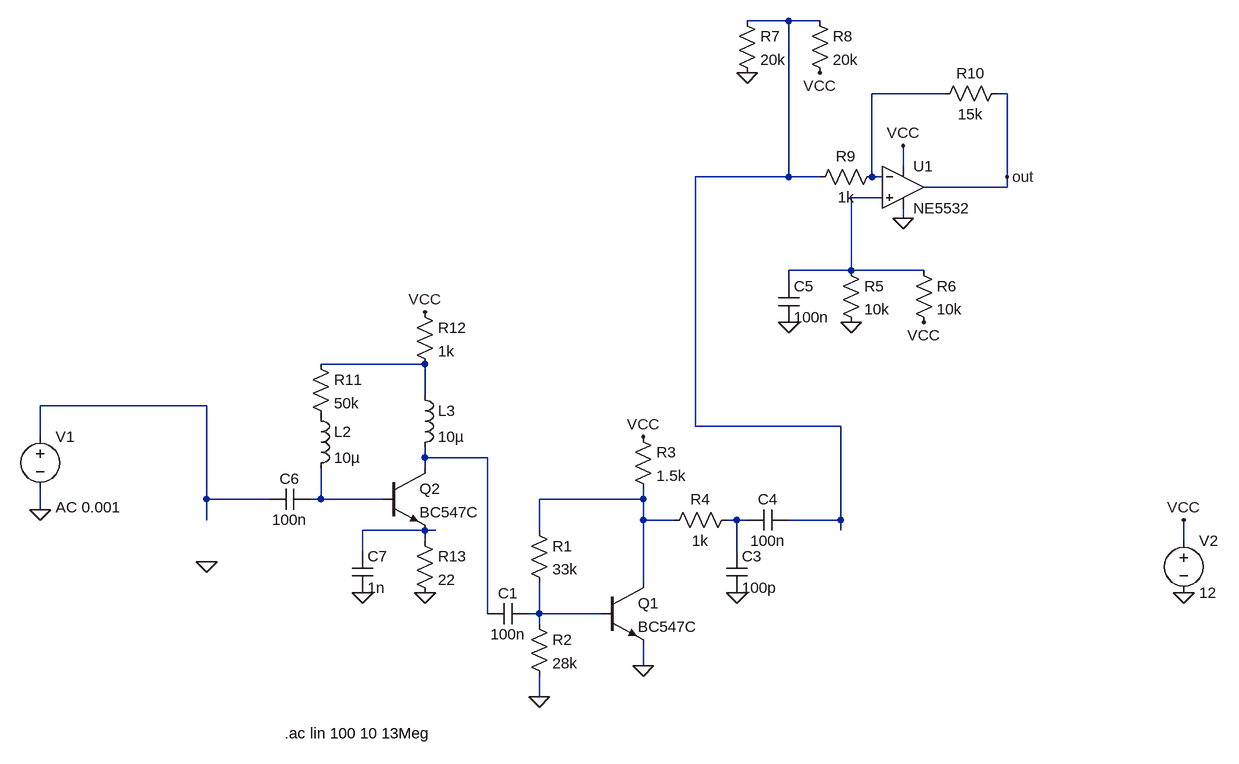
[diagram p0: schematic Draft2.asc]
Draft2.asc, the LTspice schematic file:
Version 4
SHEET 1 1608 856
WIRE 944 -256 880 -256
WIRE 992 -256 944 -256
WIRE 1184 -144 1072 -144
WIRE 1280 -144 1264 -144
WIRE 1120 -32 1120 -64
WIRE 944 -16 944 -256
WIRE 944 -16 800 -16
WIRE 992 -16 944 -16
WIRE 1072 -16 1072 -144
WIRE 1088 -16 1072 -16
WIRE 1280 -16 1280 -144
WIRE 1280 0 1280 -16
WIRE 1280 0 1152 0
WIRE 1088 16 1040 16
WIRE 1120 48 1120 32
WIRE 1040 128 1040 16
WIRE 1040 128 944 128
WIRE 1152 128 1040 128
WIRE 944 144 944 128
WIRE 384 272 224 272
WIRE 384 320 384 272
WIRE 48 336 -208 336
WIRE 800 368 800 -16
WIRE 1024 368 800 368
WIRE -208 384 -208 336
WIRE 384 416 384 400
WIRE 480 416 384 416
WIRE 384 432 384 416
WIRE 48 480 48 336
WIRE 144 480 48 480
WIRE 224 480 224 432
WIRE 224 480 208 480
WIRE 320 480 224 480
WIRE 720 480 720 464
WIRE 720 480 560 480
WIRE -208 496 -208 464
WIRE 48 512 48 480
WIRE 720 512 720 480
WIRE 768 512 720 512
WIRE 864 512 848 512
WIRE 880 512 864 512
WIRE 1024 512 1024 368
WIRE 1024 512 944 512
WIRE 384 528 288 528
WIRE 400 528 384 528
WIRE 560 528 560 480
WIRE 1024 528 1024 512
WIRE 384 544 384 528
WIRE 1552 544 1552 512
WIRE 288 560 288 528
WIRE 864 560 864 512
WIRE 720 608 720 512
WIRE 480 656 480 416
WIRE 560 656 560 608
WIRE 560 656 544 656
WIRE 656 656 560 656
WIRE 560 672 560 656
WIRE 720 736 720 704
WIRE 560 784 560 752
FLAG 720 736 0
FLAG 560 784 0
FLAG 720 384 VCC
FLAG 48 576 0
FLAG 864 624 0
FLAG 1120 48 0
FLAG 1120 -64 VCC
FLAG 1040 208 0
FLAG 1152 208 VCC
FLAG 944 208 0
FLAG 880 -176 0
FLAG 992 -176 VCC
FLAG 384 624 0
FLAG 384 192 VCC
FLAG 1280 -16 out
FLAG -208 496 0
FLAG 1552 624 0
FLAG 1552 512 VCC
FLAG 288 624 0
SYMBOL npn 656 608 R0
SYMATTR InstName Q1
SYMATTR Value BC547C
SYMBOL res 544 512 R0
SYMATTR InstName R1
SYMATTR Value 33k
SYMBOL res 544 656 R0
SYMATTR InstName R2
SYMATTR Value 28k
SYMBOL res 704 368 R0
SYMATTR InstName R3
SYMATTR Value 1.5k
SYMBOL cap 544 640 R90
WINDOW 0 0 32 VBottom 2
WINDOW 3 32 32 VTop 2
SYMATTR InstName C1
SYMATTR Value 100n
SYMBOL res 864 496 R90
WINDOW 0 0 56 VBottom 2
WINDOW 3 32 56 VTop 2
SYMATTR InstName R4
SYMATTR Value 1k
SYMBOL cap 848 560 R0
SYMATTR InstName C3
SYMATTR Value 100p
SYMBOL ZZZ\\OpAmp\\NE5532 1120 0 R0
SYMATTR InstName U1
SYMBOL cap 944 496 R90
WINDOW 0 0 32 VBottom 2
WINDOW 3 32 32 VTop 2
SYMATTR InstName C4
SYMATTR Value 100n
SYMBOL res 1024 112 R0
SYMATTR InstName R5
SYMATTR Value 10k
SYMBOL res 1136 112 R0
SYMATTR InstName R6
SYMATTR Value 10k
SYMBOL cap 928 144 R0
SYMATTR InstName C5
SYMATTR Value 100n
SYMBOL res 864 -272 R0
SYMATTR InstName R7
SYMATTR Value 20k
SYMBOL res 976 -272 R0
SYMATTR InstName R8
SYMATTR Value 20k
SYMBOL res 1088 -32 R90
WINDOW 0 0 56 VBottom 2
WINDOW 3 32 56 VTop 2
SYMATTR InstName R9
SYMATTR Value 1k
SYMBOL res 1280 -160 R90
WINDOW 0 0 56 VBottom 2
WINDOW 3 32 56 VTop 2
SYMATTR InstName R10
SYMATTR Value 15k
SYMBOL npn 320 432 R0
SYMATTR InstName Q2
SYMATTR Value BC547C
SYMBOL ind 208 336 R0
SYMATTR InstName L2
SYMATTR Value 10µ
SYMBOL ind 368 304 R0
SYMATTR InstName L3
SYMATTR Value 10µ
SYMBOL cap 208 464 R90
WINDOW 0 0 32 VBottom 2
WINDOW 3 32 32 VTop 2
SYMATTR InstName C6
SYMATTR Value 100n
SYMBOL res 208 256 R0
SYMATTR InstName R11
SYMATTR Value 50k
SYMBOL res 368 176 R0
SYMATTR InstName R12
SYMATTR Value 1k
SYMBOL res 368 528 R0
SYMATTR InstName R13
SYMATTR Value 22
SYMBOL voltage -208 368 R0
WINDOW 123 24 124 Left 2
WINDOW 39 0 0 Left 0
SYMATTR InstName V1
SYMATTR Value ""
SYMATTR Value2 AC 0.001
SYMBOL voltage 1552 528 R0
WINDOW 123 0 0 Left 0
WINDOW 39 0 0 Left 0
SYMATTR InstName V2
SYMATTR Value 12
SYMBOL cap 272 560 R0
SYMATTR InstName C7
SYMATTR Value 1n
TEXT 168 840 Left 2 !.ac lin 100 10 13Meg

The netlist it stands for:
* Draft2.asc
Q1 N008 N011 0 0 BC547C
R1 N008 N011 33k
R2 N011 0 28k
R3 VCC N008 1.5k
C1 N011 N006 100n
R4 N009 N008 1k
C3 N009 0 100p
XU1 N003 N002 VCC 0 out NE5532  ; pins In+ In- V+ V- OUT
C4 N001 N009 100n
R5 N003 0 10k
R6 N003 VCC 10k
C5 N003 0 100n
R7 N001 0 20k
R8 N001 VCC 20k
R9 N002 N001 1k
R10 out N002 15k
Q2 N006 N007 N010 0 BC547C
L2 P001 N007 10µ
L3 N004 N006 10µ
C6 N007 N005 100n
R11 N004 P001 50k
R12 VCC N004 1k
R13 N010 0 22
V1 N005 0 AC 0.001
V2 VCC 0 12
C7 N010 0 1n
.model NPN NPN
.model PNP PNP
.lib standard.bjt
.ac lin 100 10 13Meg
.backanno
.end